# EAGLE design IR Controller v2 (EAGLE 9.4.2)
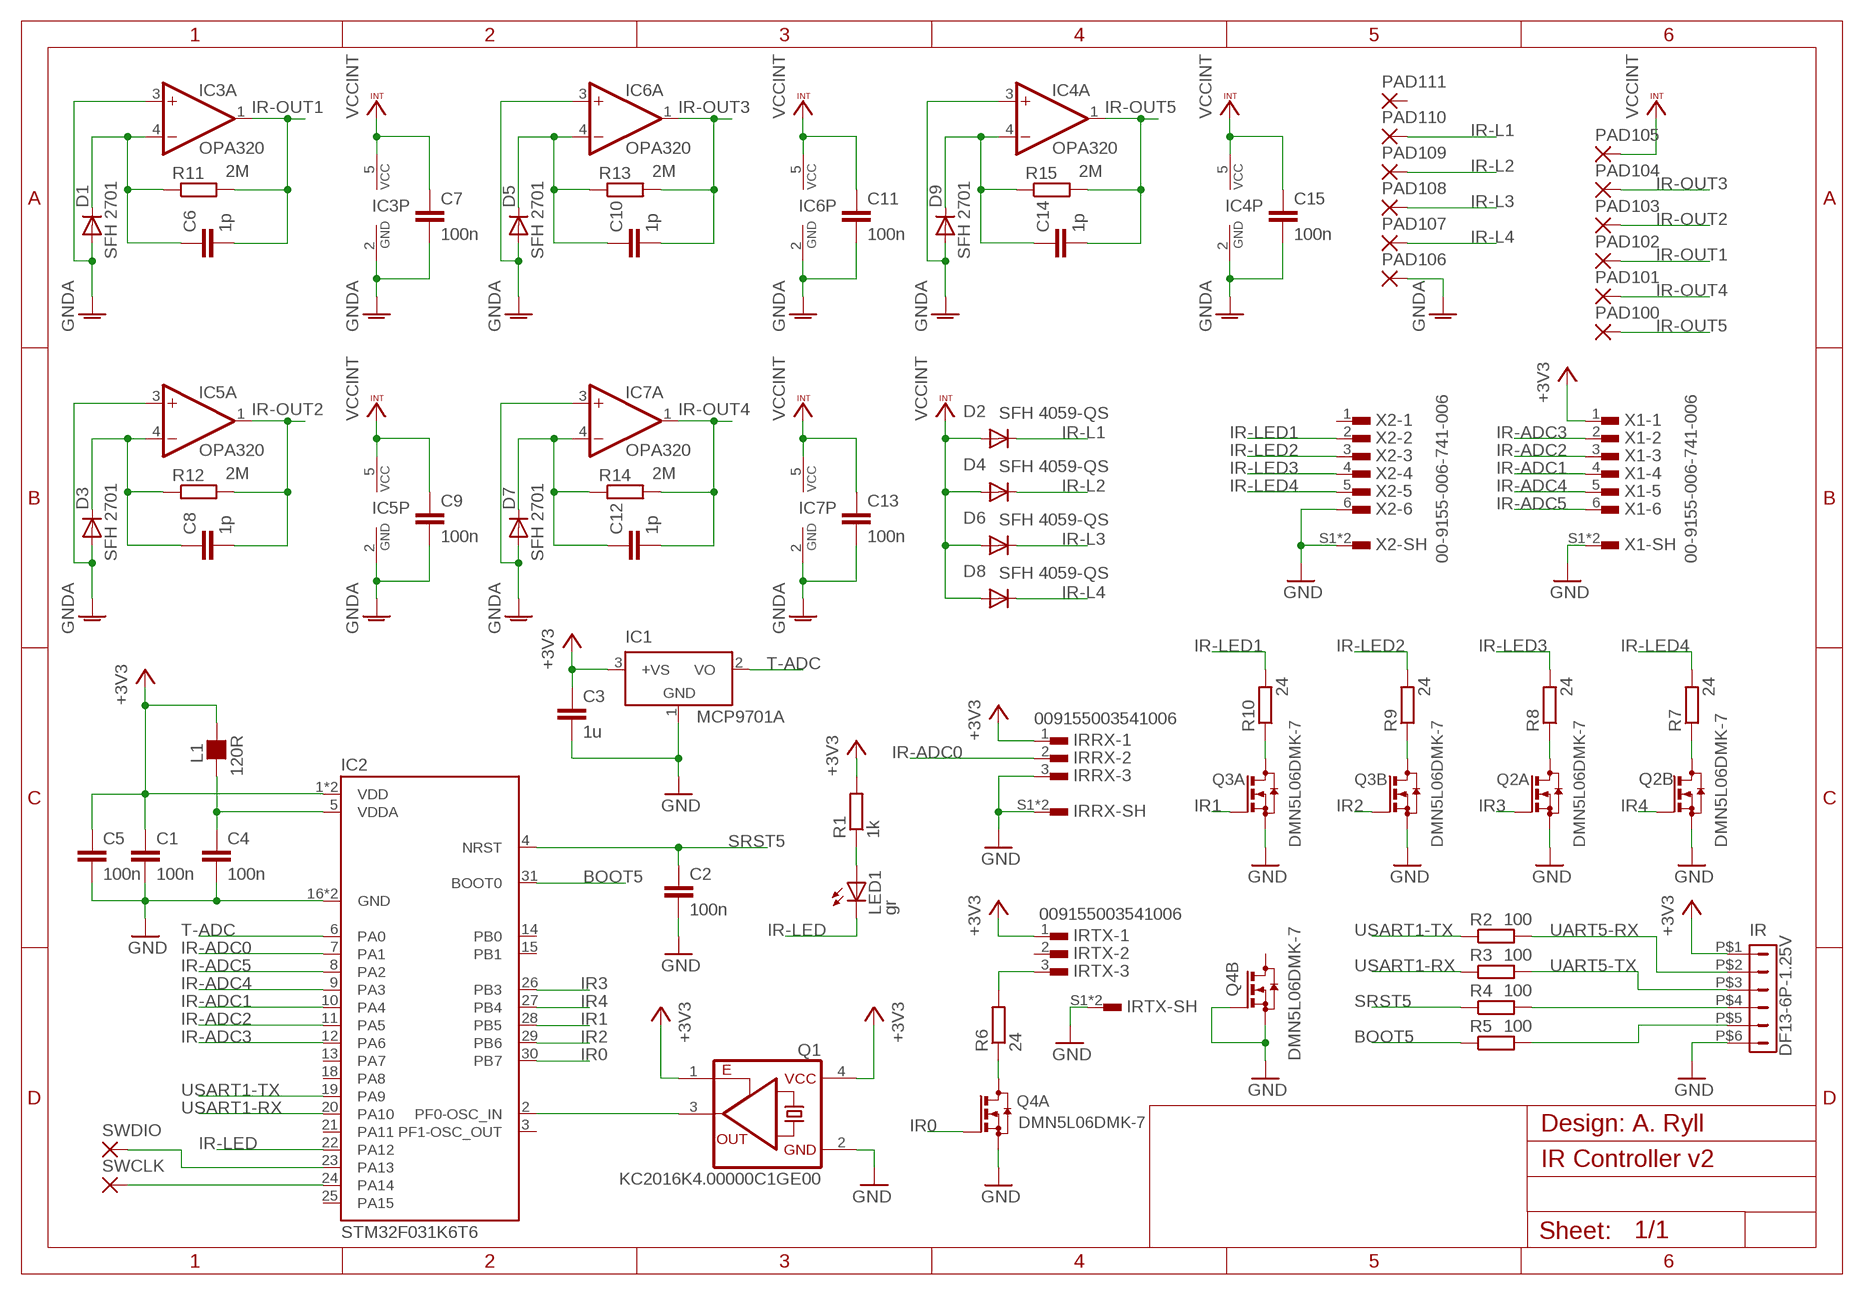
[diagram p0: schematic, sheet 1]

## Parts
C1  100n  C-EUC0603  [C0603]
C2  100n  C-EUC0603  [C0603]
C3  1u  C-EUC0603  [C0603]
C4  100n  C-EUC0603  [C0603]
C5  100n  C-EUC0603  [C0603]
C6  1p  C-EUC0603  [C0603]
C7  100n  C-EUC0603  [C0603]
C8  1p  C-EUC0603  [C0603]
C9  100n  C-EUC0603  [C0603]
C10  1p  C-EUC0603  [C0603]
C11  100n  C-EUC0603  [C0603]
C12  1p  C-EUC0603  [C0603]
C13  100n  C-EUC0603  [C0603]
C14  1p  C-EUC0603  [C0603]
C15  100n  C-EUC0603  [C0603]
D1  SFH 2701  DIODEG  [LED-GULL]
D2  SFH 4059-QS  DIODEG  [LED-GULL]
D3  SFH 2701  DIODEG  [LED-GULL]
D4  SFH 4059-QS  DIODEG  [LED-GULL]
D5  SFH 2701  DIODEG  [LED-GULL]
D6  SFH 4059-QS  DIODEG  [LED-GULL]
D7  SFH 2701  DIODEG  [LED-GULL]
D8  SFH 4059-QS  DIODEG  [LED-GULL]
D9  SFH 2701  DIODEG  [LED-GULL]
IC1  MCP9701A  LM60P  [TO92]
IC2  STM32F031K6T6  STM32F031K_TT  [LQFP32-ST]
IC3  OPA320  AD-OP1RT  [SOT23-5]
IC4  OPA320  AD-OP1RT  [SOT23-5]
IC5  OPA320  AD-OP1RT  [SOT23-5]
IC6  OPA320  AD-OP1RT  [SOT23-5]
IC7  OPA320  AD-OP1RT  [SOT23-5]
IR  DF13-6P-1.25V  [DF13C-6P-1.25V]
IRRX  009155003541006  AVX-CON3  [AVX-CON3]
IRTX  009155003541006  AVX-CON3  [AVX-CON3]
L1  120R  FB_0603  [L0603]
LED1  gr  LEDCHIP-LED0603  [CHIP-LED0603]
PAD100  WIREPADSMD1,4-3  [SMD1,4-3]
PAD101  WIREPADSMD1,4-3  [SMD1,4-3]
PAD102  WIREPADSMD1,4-3  [SMD1,4-3]
PAD103  WIREPADSMD1,4-3  [SMD1,4-3]
PAD104  WIREPADSMD1,4-3  [SMD1,4-3]
PAD105  WIREPADSMD1,4-3  [SMD1,4-3]
PAD106  WIREPADSMD1,4-3  [SMD1,4-3]
PAD107  WIREPADSMD1,4-3  [SMD1,4-3]
PAD108  WIREPADSMD1,4-3  [SMD1,4-3]
PAD109  WIREPADSMD1,4-3  [SMD1,4-3]
PAD110  WIREPADSMD1,4-3  [SMD1,4-3]
PAD111  WIREPADSMD1,4-3  [SMD1,4-3]
Q1  KC2016K4.00000C1GE00  OSCIKC2016  [OSCI-KC2016]
Q2  DMN5L06DMK-7  NMOS2  [SOT26]
Q3  DMN5L06DMK-7  NMOS2  [SOT26]
Q4  DMN5L06DMK-7  NMOS2  [SOT26]
R1  1k  R-EU_R0603  [R0603]
R2  100  R-EU_R0805  [R0805]
R3  100  R-EU_R0805  [R0805]
R4  100  R-EU_R0805  [R0805]
R5  100  R-EU_R0805  [R0805]
R6  24  R-EU_R0805  [R0805]
R7  24  R-EU_R0805  [R0805]
R8  24  R-EU_R0805  [R0805]
R9  24  R-EU_R0805  [R0805]
R10  24  R-EU_R0805  [R0805]
R11  2M  R-EU_R0603  [R0603]
R12  2M  R-EU_R0603  [R0603]
R13  2M  R-EU_R0603  [R0603]
R14  2M  R-EU_R0603  [R0603]
R15  2M  R-EU_R0603  [R0603]
SWCLK  WIREPADSMD1,27-254  [SMD1,27-2,54]
SWDIO  WIREPADSMD1,27-254  [SMD1,27-2,54]
X1  00-9155-006-741-006  AVX-CON6  [AVX-CON6-2MM]
X2  00-9155-006-741-006  AVX-CON6  [AVX-CON6-2MM]

## Nets
+3V3: C1.1 C3.1 C5.1 IC1.3(+VS) IC2.1(VDD) IC2.17(VDD) IR.P$1 IRRX.1 IRTX.1 L1.2 Q1.1(OE) Q1.4(VCC) R1.2 X1.1
BOOT5: IC2.31(BOOT0) R5.1
GND: C1.2 C2.2 C3.2 C4.2 C5.2 IC1.1(GND) IC2.16(GND) IC2.32(GND) IR.P$6 IRRX.3 IRRX.S1 IRRX.S2 IRTX.S1 IRTX.S2 Q1.2(GND) Q2.1(B:S) Q2.4(A:S) Q3.1(B:S) Q3.4(A:S) Q4.1(B:S) Q4.2(B:G) Q4.4(A:S) X1.S1 X1.S2 X2.6 X2.S1 X2.S2
GNDA: C7.2 C9.2 C11.2 C13.2 C15.2 D1.A D3.A D5.A D7.A D9.A IC3.2(P:GND) IC3.3(A:+IN) IC4.2(P:GND) IC4.3(A:+IN) IC5.2(P:GND) IC5.3(A:+IN) IC6.2(P:GND) IC6.3(A:+IN) IC7.2(P:GND) IC7.3(A:+IN) PAD106.1(P)
IR0: IC2.30(PB7) Q4.5(A:G)
IR1: IC2.28(PB5) Q3.5(A:G)
IR2: IC2.29(PB6) Q3.2(B:G)
IR3: IC2.26(PB3) Q2.5(A:G)
IR4: IC2.27(PB4) Q2.2(B:G)
IR-ADC0: IC2.7(PA1) IRRX.2
IR-ADC1: IC2.10(PA4) X1.4
IR-ADC2: IC2.11(PA5) X1.3
IR-ADC3: IC2.12(PA6) X1.2
IR-ADC4: IC2.9(PA3) X1.5
IR-ADC5: IC2.8(PA2) X1.6
IR-L1: D2.C PAD110.1(P)
IR-L2: D4.C PAD109.1(P)
IR-L3: D6.C PAD108.1(P)
IR-L4: D8.C PAD107.1(P)
IR-LED: IC2.22(PA12) LED1.C
IR-LED1: R10.2 X2.2
IR-LED2: R9.2 X2.3
IR-LED3: R8.2 X2.4
IR-LED4: R7.2 X2.5
IR-OUT1: C6.2 IC3.1(A:OUT) PAD102.1(P) R11.2
IR-OUT2: C8.2 IC5.1(A:OUT) PAD103.1(P) R12.2
IR-OUT3: C10.2 IC6.1(A:OUT) PAD104.1(P) R13.2
IR-OUT4: C12.2 IC7.1(A:OUT) PAD101.1(P) R14.2
IR-OUT5: C14.2 IC4.1(A:OUT) PAD100.1(P) R15.2
N$1: IR.P$4 R4.2
N$2: IC2.23(PA13) SWDIO.1(P)
N$4: IR.P$5 R5.2
N$6: IC2.24(PA14) SWCLK.1(P)
N$9: C14.1 D9.C IC4.4(A:-IN) R15.1
N$51: C10.1 D5.C IC6.4(A:-IN) R13.1
N$52: C8.1 D3.C IC5.4(A:-IN) R12.1
N$55: Q3.3(A:D) R10.1
N$57: C6.1 D1.C IC3.4(A:-IN) R11.1
N$59: IC2.2(PF0-OSC_IN) Q1.3(FO)
N$65: C4.1 IC2.5(VDDA) L1.1
N$66: IRTX.3 R6.2
N$68: C12.1 D7.C IC7.4(A:-IN) R14.1
N$69: Q4.3(A:D) R6.1
N$113: Q3.6(B:D) R9.1
N$115: Q2.3(A:D) R8.1
N$117: Q2.6(B:D) R7.1
N$122: LED1.A R1.1
SRST5: C2.1 IC2.4(NRST) R4.1
T-ADC: IC1.2(VO) IC2.6(PA0)
UART5-RX: IR.P$2 R2.2
UART5-TX: IR.P$3 R3.2
USART1-RX: IC2.20(PA10) R3.1
USART1-TX: IC2.19(PA9) R2.1
VCCINT: C7.1 C9.1 C11.1 C13.1 C15.1 D2.A D4.A D6.A D8.A IC3.5(P:VCC) IC4.5(P:VCC) IC5.5(P:VCC) IC6.5(P:VCC) IC7.5(P:VCC) PAD105.1(P)
Unconnected: IC2.3(PF1-OSC_OUT) IC2.13(PA7) IC2.14(PB0) IC2.15(PB1) IC2.18(PA8) IC2.21(PA11) IC2.25(PA15) IRTX.2 PAD111.1(P) Q4.6(B:D) X2.1

## Notes on the sheet
- Design: A. Ryll

## Library data of the parts
C1-C15 = rcl:C-EU: CAPACITOR, European symbol; SPICEPREFIX: C
D1-D9 = TIGERs:DIODE
IC1 = TIGERs:LM60: LM60 Temperature Sensor -40°C to 125°C
IC2 = TIGERs:STM32F031K_T
IC3-IC7 = TIGERs:AD-OP1
IR = con-hirose-df13:DF13-6P-1.25: DF13-6P 1.25mm Pitch Miniature Crimping Connector.
IRRX IRTX = TIGERs:AVX-CON3
L1 = rc-master-smd:FB_: FERRITE BEAD
LED1 = led:LED: LED OSRAM: - CHIPLED LG R971, LG N971, LY N971, LG Q971, LY Q971, LO R971, LY R971 LH N974, LH R974 LS Q976, LO Q976, LY Q976 LO Q996 - Hyper CHIPLED LW Q18S LB Q993, LB Q99A, LB R99A - SideLED LS A670, LO A670, LY A670, LG A670, LP A670 LB A673, LV A673, LT A673, LW A673 LH A674 LY A675 LS A676, LA A676, LO A676, LY A676, LW A676 LS A679, LY A679, LG A679 - Hyper Micro SIDELED® LS Y876, LA Y876, LO Y876, LY Y876 LT Y87S - SmartLED LW L88C, LW L88S LB L89C, LB L89S, LG L890 LS L89K, LO L89K, LY L89K LS L896, LA L896, LO L896, LY L896 - TOPLED LS T670, LO T670, LY T670, LG T670, LP T670 LSG T670, LSP T670, LSY T670, LOP T670, LYG T670 LG T671, LOG T671, LSG T671 LB T673, LV T673, LT T673, LW T673 LH T674 LS T676, LA T676, LO T676, LY T676, LB T676, LH T676, LSB T676, LW T676 LB T67C, LV T67C, LT T67C, LS T67K, LO T67K, LY T67K, LW E67C LS E67B, LA E67B, LO E67B, LY E67B, LB E67C, LV E67C, LT E67C LW T67C LS T679, LY T679, LG T679 LS T770, LO T770, LY T770, LG T770, LP T770 LB T773, LV T773, LT T773, LW T773 LH T774 LS E675, LA E675, LY E675, LS T675 LS T776, LA T776, LO T776, LY T776, LB T776 LHGB T686 LT T68C, LB T68C - Hyper Mini TOPLED® LB M676 - Mini TOPLED Santana® LG M470 LS M47K, LO M47K, LY M47K Source: http://www.osram.convergy.de LUXEON: - LUMILED® LXK2-PW12-R00, LXK2-PW12-S00, LXK2-PW14-U00, LXK2-PW14-V00 LXK2-PM12-R00, LXK2-PM12-S00, LXK2-PM14-U00 LXK2-PE12-Q00, LXK2-PE12-R00, LXK2-PE12-S00, LXK2-PE14-T00, LXK2-PE14-U00 LXK2-PB12-K00, LXK2-PB12-L00, LXK2-PB12-M00, LXK2-PB14-N00, LXK2-PB14-P00, LXK2-PB14-Q00 LXK2-PR12-L00, LXK2-PR12-M00, LXK2-PR14-Q00, LXK2-PR14-R00 LXK2-PD12-Q00, LXK2-PD12-R00, LXK2-PD12-S00 LXK2-PH12-R00, LXK2-PH12-S00 LXK2-PL12-P00, LXK2-PL12-Q00, LXK2-PL12-R00 Source: www.luxeon.com KINGBRIGHT: KA-3528ASYC Source: www.kingbright.com; SPICEPREFIX: D
PAD100-PAD111 SWCLK SWDIO = TIGERs:WIREPAD: Wire PAD connect wire on PCB
Q1 = TIGERs:OSCI
Q2-Q4 = TIGERs:NMOS2
R1-R15 = rcl:R-EU_: RESISTOR, European symbol; SPICEPREFIX: R
X1 X2 = TIGERs:AVX-CON6

## Board
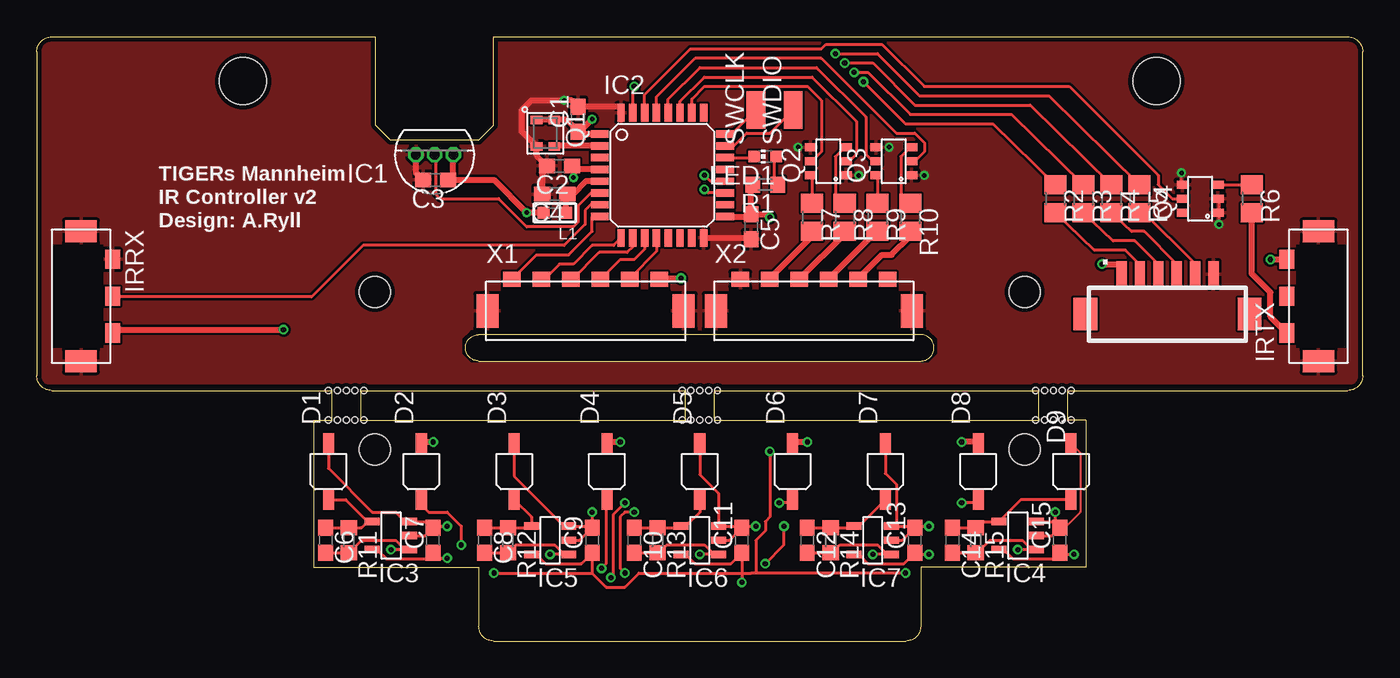
[diagram p1: board, top side]
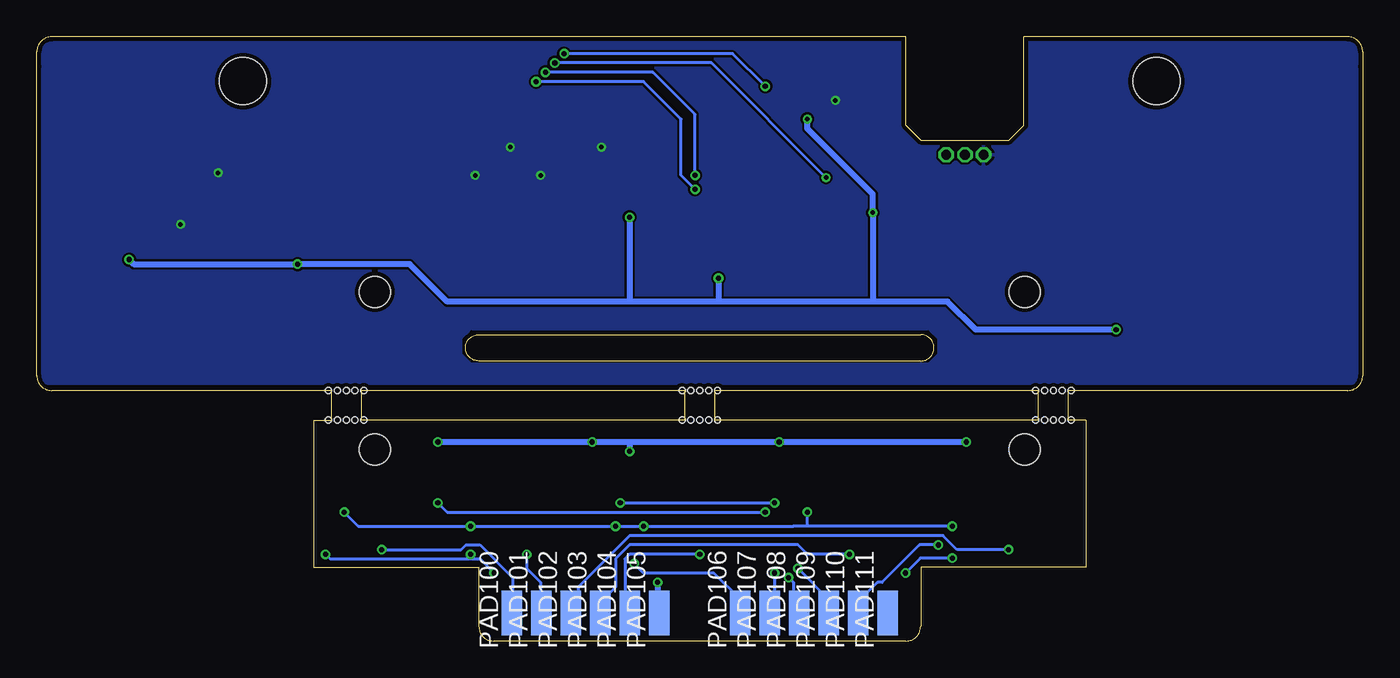
[diagram p2: board, bottom side, seen from below]

Size 90 x 41 mm. Coordinates in mm from the lower left corner, seen from the top.
Outline: 22,15 22,17
Outline: 90,18 90,39 90,40 arc90 89,41 31,41 31,35 30,34 24,34 23,35 23,41 1,41 arc90 0,40 0,39 0,18 arc90 1,17 20,17 20,15 18.8,15 18.8,5 30,5 30,1 arc90 31,0 59,0 arc90 60,1 60,5 71.2,5 71.2,15 70,15 70,17 89,17 arc90 90,18
Copper layers (1*16): Top 0.035mm / dielectric 1.5mm / Bottom 0.035mm
Design rules "PCB-POOL Standard *": minimum track width 0.15mm, minimum drill 0.3mm, track to track 0.15mm, track to pad 0.15mm, pad to pad 0.15mm, via to via 0.15mm, smd to smd 0.15mm, copper to edge 0.3mm, drill to drill 0.2mm, minimum pad ring 0.2mm, minimum via ring 0.15mm, stop-mask expansion 0.075mm, vias tented up to drill 14mil, thermal gap 0.2mm
Holes 3.2 mm at 14,38 76,38
Holes 2.1 mm at 22.95,23.7 67.05,23.7 22.95,13 67.05,13
Holes 0.4 mm at 21,15 21.6,15 22.2,15 20.4,15 19.8,15 21,17 21.6,17 22.2,17 20.4,17 19.8,17 45,15 45.6,15 46.2,15 44.4,15 43.8,15 45,17 45.6,17 46.2,17 44.4,17 43.8,17 69,15 69.6,15 70.2,15 68.4,15 67.8,15 69,17 69.6,17 70.2,17 68.4,17 67.8,17
tKeepout: area 11,35 to 17,41; area 73,35 to 79,41; area 20.9,21.7 to 24.9,25.7; area 65,21.7 to 69,25.7; area 20.9,11 to 24.9,15; area 65,11 to 69,15
Milling: 12 lines

### Footprints (pad centres in the part's own frame; a part is rotated, then mirrored left to right if it is on the bottom)
C0603 = smd 1.1 x 1: 1 -0.85,0; 2 0.85,0
LED-GULL = smd 1.4 x 0.75: A 1.9,0; C -1.9,0
TO92 = drill 0.65 pad 0.813 octagon: 1 1.27,0; 2 0,0; 3 -1.27,0
LQFP32-ST = smd 1.2 x 0.5: 1 -4.25,2.8; 2 -4.25,2; 3 -4.25,1.2; 4 -4.25,0.4; 5 -4.25,-0.4; 6 -4.25,-1.2; 7 -4.25,-2; 8 -4.25,-2.8; 17 4.25,-2.8; 18 4.25,-2; 19 4.25,-1.2; 20 4.25,-0.4; 21 4.25,0.4; 22 4.25,1.2; 23 4.25,2; 24 4.25,2.8 | smd 0.5 x 1.2: 9 -2.8,-4.25; 10 -2,-4.25; 11 -1.2,-4.25; 12 -0.4,-4.25; 13 0.4,-4.25; 14 1.2,-4.25; 15 2,-4.25; 16 2.8,-4.25; 25 2.8,4.25; 26 2,4.25; 27 1.2,4.25; 28 0.4,4.25; 29 -0.4,4.25; 30 -1.2,4.25; 31 -2,4.25; 32 -2.8,4.25
SOT23-5 = smd 1.016 x 0.508: 1 -1.27,0.953; 2 -1.27,0; 3 -1.27,-0.953; 4 1.27,-0.953; 5 1.27,0.953
DF13C-6P-1.25V = smd 1.6 x 2.2: M$0 5.575,-1.8; M$1 -5.575,-1.8 | smd 0.7 x 1.8: P$1 -3.125,0.9; P$2 -1.875,0.9; P$3 -0.625,0.9; P$4 0.625,0.9; P$5 1.875,0.9; P$6 3.125,0.9
AVX-CON3 = smd 1.3 x 1: 1 2.5,2.15; 2 0,2.15; 3 -2.5,2.15 | smd 1.5 x 2.15: S1 4.4,0; S2 -4.4,0
L0603 = smd 0.8 x 0.8: 1 -0.762,0; 2 0.762,0
CHIP-LED0603 = smd 0.8 x 0.8: A 0,-0.75; C 0,0.75
SMD1,4-3 = smd 1.4 x 3: 1 0,0
OSCI-KC2016 = smd 0.6 x 0.8: 1 -0.9,-0.6; 2 0.9,-0.6; 3 0.9,0.6; 4 -0.9,0.6
SOT26 = smd 0.55 x 0.8: 1 -0.95,-1.2; 2 0,-1.2; 3 0.95,-1.2; 4 0.95,1.2; 5 0,1.2; 6 -0.95,1.2
R0603 = smd 1 x 1.1: 1 -0.85,0; 2 0.85,0
R0805 = smd 1.3 x 1.5: 1 -0.95,0; 2 0.95,0
SMD1,27-2,54 = smd 1.27 x 2.54: 1 0,0
AVX-CON6-2MM = smd 1.2 x 1: 1 5,2.15; 2 3,2.15; 3 1,2.15; 4 -1,2.15; 5 -3,2.15; 6 -5,2.15 | smd 1.5 x 2.3: S1 6.65,0; S2 -6.65,0

### Placement (x,y rotation side)
C1  36.74,35.41 90 top
C2  35.48,32.24 180 top
C3  27.06,31.29 180 top
C4  35.16,30.34 180 top
C5  48.49,28.11 270 top
C6  19.6,6.84 270 top
C7  26.9,6.84 90 top
C8  30.39,6.84 270 top
C9  37.7,6.84 90 top
C10  40.55,6.84 270 top
C11  47.86,6.84 90 top
C12  52.3,6.84 270 top
C13  59.61,6.84 90 top
C14  62.14,6.84 270 top
C15  69.45,6.84 90 top
D1  19.8,11.5 90 top
D2  26.1,11.5 90 top
D3  32.4,11.5 90 top
D4  38.7,11.5 90 top
D5  45,11.5 90 top
D6  51.3,11.5 90 top
D7  57.6,11.5 90 top
D8  63.9,11.5 90 top
D9  70.2,11.5 90 top
IC1  27,33 180 top
IC2  42.46,31.61 0 top
IC3  24.05,7.16 180 top
IC4  66.59,7.16 180 top
IC5  34.84,6.84 180 top
IC6  45,6.84 180 top
IC7  56.75,6.84 180 top
IR  76.75,23.98 0 top
IRRX  3,23.4 270 top
IRTX  87,23.4 90 top
L1  35.16,29.06 180 top
LED1  49.45,32.88 90 top
PAD100  57.75,1.9 0 bottom
PAD101  55.75,1.9 0 bottom
PAD102  53.75,1.9 0 bottom
PAD103  51.75,1.9 0 bottom
PAD104  49.75,1.9 0 bottom
PAD105  47.75,1.9 0 bottom
PAD106  42.25,1.9 0 bottom
PAD107  40.25,1.9 0 bottom
PAD108  38.25,1.9 0 bottom
PAD109  36.25,1.9 0 bottom
PAD110  34.25,1.9 0 bottom
PAD111  32.25,1.9 0 bottom
Q1  34.52,34.46 270 top
Q2  53.73,32.56 90 top
Q3  58.18,32.56 90 top
Q4  78.97,30.02 90 top
R1  49.45,30.97 180 top
R2  69.13,30.02 270 top
R3  71.03,30.02 270 top
R4  72.94,30.02 270 top
R5  74.84,30.02 270 top
R6  82.47,30.02 270 top
R7  52.62,28.75 270 top
R8  54.84,28.75 270 top
R9  57.06,28.75 270 top
R10  59.29,28.75 270 top
R11  21.19,6.84 270 top
R12  31.98,6.84 270 top
R13  42.14,6.84 270 top
R14  53.89,6.84 270 top
R15  63.73,6.84 270 top
SWCLK  48.81,36.05 0 top
SWDIO  51.35,36.05 0 top
X1  37.25,22.4 0 top
X2  52.75,22.4 0 top

### Tracks (layer width: path | path; a pad name or v marks a point on that pad's centre or on a via)
+3V3  (via drill 0.3, 0.35)
  Top 0.406: C1.1 36.85,34.56 v37.7,35.41 | IC2.1 36.91,34.41 C1.1 | C1.1 35.95,35.36 Q1.4 Q1.1 | L1.2 v33.25,29.06 31.03,31.29 C3.1 28.27,31.65 IC1.3 | IC2.17 48.34,28.8 C5.1 | IRRX.1 5.4,20.9 5.63,21.13 v16.74,21.13 | X1.1 42.32,24.62 v43.73,24.62 | v49.76,28.75 49.55,28.96 C5.1 | C5.1 48.49,30.87 R1.2 | v72.31,25.57 73.58,25.57 73.62,25.52 IR.P$1 | IRTX.1 v83.73,25.89
  Bottom 0.406: v37.7,35.41 37.7,34.78 33.25,30.34 v33.25,29.06 33.25,23.03 | v16.74,21.13 26.27,21.13 28.17,23.03 33.25,23.03 | 33.25,23.03 43.73,23.03 | 43.73,23.03 49.76,23.03 | v43.73,24.62 43.73,23.03 | v49.76,28.75 49.76,23.03 | 49.76,23.03 62.14,23.03 64.69,25.57 v72.31,25.57 83.42,25.57 v83.73,25.89
BOOT5  (via drill 0.35)
  Top 0.203: IC2.31 40.46,37.54 v40.55,37.64 | v54.21,39.86 57.06,39.86 59.92,37 68.71,37 R5.1
  Bottom 0.203: v40.55,37.64 42.78,39.86 v54.21,39.86
GND  (via drill 0.3)
  Top 0.203: Q4.4 77.7,31.04 v77.7,31.76 | Q4.1 80.24,29 | 80.24,29 v80.24,28.27 | Q4.2 80.24,29.95 80.24,29
  Top 0.406: IC2.32 39.66,36.27 C1.2 36.33,36.69 v35.79,36.69 33.57,36.69 32.94,36.05 32.94,34.55 Q1.2 33.92,32.94 C2.2 34.31,31.92 C4.2 | IC2.16 48.4,27.36 C5.2 | C3.2 25.73,31.77 IC1.1
  other vias: 55.8,31.61 57.86,33.51 60.24,31.61 51.67,33.51
  pour Top: 0,41 90,41 90,17.5 0,17.5
  pour Bottom: 0,41 90,41 90,17.5 0,17.5
  cutout Top: 29,20 29,20.5 29.5,21 60.5,21 61,20.5 61,19.5 60.5,19 29.5,19 29,19.5
  cutout Bottom: 61,20 61,20.5 60.5,21 29.5,21 29,20.5 29,19.5 29.5,19 60.5,19 61,19.5
GNDA  (via drill 0.35)
  Top 0.152: D9.A 70.82,12.78 70.82,8.74 69.77,7.69 C15.2
  Top 0.203: D1.A 19.8,11.72 22.77,8.74 24.36,8.74 25,8.11 IC3.3 26.48,8.11 C7.2 | IC3.2 26.37,7.16 C7.2 | IC5.2 36.85,6.84 C9.2 37.65,7.74 | 37.65,7.74 37.59,7.79 IC5.3 35.79,7.79 32.4,11.18 D3.A | IC6.2 47.01,6.84 C11.2 | C11.2 47.76,7.79 IC6.3 46.27,10.02 45,11.29 D5.A | IC7.2 58.76,6.84 C13.2 | IC7.3 58.34,7.79 | 58.34,7.79 59.5,7.79 C13.2 | D7.A 57.6,11.38 58.34,10.65 58.34,7.79 | IC4.2 68.91,7.16 C15.2 | IC4.3 69.03,8.11 C15.2 | C7.2 27,7.79 v27.86,7.79 | 37.65,7.74 37.7,7.79 v37.7,8.74 | C11.2 47.96,7.79 v48.81,7.79 | C13.2 59.71,7.79 v60.56,7.79 | C15.2 69.13,8.01 v69.13,8.74 | v49.45,5.25 50.72,6.52 v50.72,7.79
  Bottom 0.203: v27.86,7.79 37.7,7.79 | 37.7,7.79 38.65,7.79 v48.81,7.79 v50.72,7.79 v60.56,7.79 68.18,7.79 v69.13,8.74 | 37.7,7.79 v37.7,8.74 | PAD106.1 42.25,2.82 44.05,4.62 48.81,4.62 v49.45,5.25
IR0
  Top 0.203: IC2.30 41.26,37.07 44.37,40.18 53.26,40.18 53.57,40.5 57.38,40.5 60.24,37.64 70.08,37.64 76.11,31.61 76.11,30.97 77.07,30.02 Q4.5
IR1
  Top 0.203: IC2.28 42.86,36.77 45,38.91 52.94,38.91 56.27,35.57 56.27,33.03 56.75,32.56 Q3.5
IR2
  Top 0.203: IC2.29 42.06,36.92 44.68,39.54 53.26,39.54 58.34,34.46 59.61,34.46 60.24,33.83 60.24,33.19 59.61,32.56 Q3.2
IR3
  Top 0.203: Q2.5 52.62,32.56 53.26,33.19 53.26,36.69 52.3,37.64 45.32,37.64 44.46,36.78 IC2.26
IR4
  Top 0.203: Q2.2 55.16,32.56 55.64,33.03 55.64,35.26 52.62,38.27 45.32,38.27 43.66,36.61 IC2.27
IR-ADC0
  Top 0.203: IC2.7 37.6,29.61 37.22,29.22 37.22,28.27 35.79,26.84 22.14,26.84 18.65,23.35 5.2,23.35 IRRX.2
IR-ADC1
  Top 0.203: IC2.10 40.46,26.75 40.08,26.37 38.17,26.37 36.36,24.55 X1.4
IR-ADC2
  Top 0.203: IC2.11 41.26,26.59 40.55,25.89 39.59,25.89 X1.3
IR-ADC3
  Top 0.203: IC2.12 42.06,26.44 40.25,24.63 X1.2
IR-ADC4
  Top 0.203: 34.25,24.66 X1.5 34.45,24.55 35.48,25.57 36.43,25.57 37.7,26.84 39.15,26.84 IC2.9
IR-ADC5
  Top 0.203: IC2.8 37.76,28.8 37.7,28.75 37.7,27.8 36.11,26.21 33.91,26.21 X1.6
IR-L1  (via drill 0.35)
  Top 0.203: D2.C 26.1,9.23 26.59,8.74 27.86,8.74 28.81,7.79 v28.81,6.52
  Bottom 0.203: v28.81,6.52 30.08,6.52 32.62,3.98 32.94,3.98 34.25,2.67 PAD110.1
IR-L2  (via drill 0.35)
  Top 0.203: 38.7,9.33 D4.C 38.65,9.55 38.65,5.25 v38.33,4.94
  Bottom 0.203: PAD109.1 36.25,2.85 v38.33,4.94
IR-L3  (via drill 0.35)
  Top 0.203: 51.3,9.33 D6.C 51.08,9.38 v50.4,9.38 | v39.92,9.38 39.13,8.59 39.13,4.46 v38.97,4.3
  Bottom 0.203: v50.4,9.38 v39.92,9.38 | v38.97,4.3 38.65,3.98 38.65,2.3 PAD108.1
IR-L4  (via drill 0.35)
  Top 0.203: 63.9,9.23 D8.C 63.68,9.38 v62.78,9.38 | v40.55,8.74 39.92,8.74 39.6,8.43 39.6,4.94 v39.92,4.62
  Bottom 0.203: 40.55,2.21 40.33,1.98 | 40.33,1.98 PAD107.1 | v62.78,9.38 62.14,8.74 v40.55,8.74 | 40.33,1.98 39.92,2.39 v39.92,4.62
IR-LED
  Top 0.203: IC2.22 48.77,32.8 LED1.C
IR-LED1
  Top 0.203: X2.2 55.75,24.57
  Top 0.406: 55.75,24.57 57.38,26.21 58.02,26.21 59.29,27.48 R10.2
IR-LED2
  Top 0.406: X2.3 57,27.8 R9.2
IR-LED3
  Top 0.406: R8.2 54.84,27.64 X2.4
IR-LED4
  Top 0.406: X2.5 49.75,24.61 52.62,27.48 R7.2
IR-OUT1  (via drill 0.35)
  Top 0.203: C6.2 R11.2 22.04,6.84 24.36,6.84 25,6.21 IC3.1 v24.05,6.21
  Bottom 0.203: v24.05,6.21 27.54,6.21 28.49,7.16 49.76,7.16 53.26,3.66 53.26,2.39 PAD102.1
IR-OUT2  (via drill 0.35)
  Top 0.203: C8.2 R12.2 32.52,6.52 35.16,6.52 35.79,5.89 IC5.1 v34.84,5.89
  Bottom 0.203: v34.84,5.89 37.7,5.89 38.33,6.52 49.76,6.52 50.72,5.57 50.72,3.66 51.75,2.63 PAD103.1
IR-OUT3  (via drill 0.35)
  Top 0.203: C10.2 R13.2 42.24,5.99 42.78,6.52 45.32,6.52 45.95,5.89 IC6.1 v45,5.89
  Bottom 0.203: v45,5.89 49.76,5.89 50.08,5.57 50.08,2.23 PAD104.1
IR-OUT4  (via drill 0.35)
  Top 0.203: C12.2 R14.2 53.99,5.99 54.52,6.52 57.06,6.52 57.7,5.89 IC7.1 v56.75,5.89
  Bottom 0.203: v56.75,5.89 56.75,4.94 55.8,3.98 55.8,1.95 PAD101.1
IR-OUT5  (via drill 0.35)
  Top 0.203: C14.2 R15.2 63.84,5.99 64.69,6.84 66.91,6.84 67.54,6.21 IC4.1 v66.59,6.21
  Bottom 0.203: v66.59,6.21 61.19,6.21 60.88,6.52 59.92,6.52 57.7,4.3 57.7,1.95 PAD100.1
N$1
  Top 0.203: IR.P$4 77.38,25.58 75.16,27.8 74.31,27.8 R4.2
N$2
  Top 0.203: IC2.23 47.32,33.61 48.17,34.46 49.76,34.46 SWDIO.1
N$4
  Top 0.203: IR.P$5 78.62,25.6 75.06,29.17 R5.2
N$6
  Top 0.203: IC2.24 47.16,34.41 SWCLK.1
N$9
  Top 0.203: C14.1 R15.1 64.05,8.01 64.05,8.11 IC4.4 66.81,9.6 D9.C
N$51
  Top 0.203: C10.1 R13.1 43.63,7.69 IC6.4 44.05,7.79 45,8.74 D5.C
N$52
  Top 0.203: C8.1 R12.1 33.47,7.69 IC5.4 33.57,8.43 D3.C
N$55
  Top 0.203: Q3.3 59.28,33.51 58.65,32.88 58.65,30.02 58.97,29.7 R10.1
N$57
  Top 0.203: 19.92,9.48 D1.C 20.97,9.6 22.46,8.11 | 19.92,8.01 C6.1 R11.1 22.04,7.69 22.46,8.11 | 22.46,8.11 IC3.4
N$59
  Top 0.406: IC2.2 35.16,33.61 Q1.3
N$65
  Top 0.406: IC2.5 37.3,31.2 36.43,30.34 C4.1 35.92,30.25 L1.1
N$66
  Top 0.406: IRTX.3 83.73,22.02 83.73,23.67 82.47,24.94 R6.2
N$68
  Top 0.203: C12.1 R14.1 55.38,7.69 IC7.4 55.79,7.79 D7.C
N$69
  Top 0.203: Q4.3 R6.1
N$113
  Top 0.203: Q3.6 57.06,31.52 R9.1
N$115
  Top 0.203: Q2.3 54.84,33.51 54.21,32.88 54.21,30.33 R8.1
N$117
  Top 0.203: Q2.6 52.62,31.52 R7.1
N$122
  Top 0.203: R1.1 50.08,31.19 50.08,32.76 LED1.A
SRST5  (via drill 0.3, 0.35)
  Top 0.203: v54.84,39.23 56.75,39.23 59.61,36.37 67.44,36.37 R4.1
  Top 0.406: v36.43,31.45 36.43,32.14 C2.1 36.56,32.01 IC2.4
  Bottom 0.203: v36.43,31.45 44.21,39.23 v54.84,39.23
T-ADC
  Top 0.203: IC2.6 37.61,30.41 36.74,29.54 36.74,28.43 36.43,28.11 33.25,28.11 31.35,30.02 27.38,30.02 27.06,30.34 27.06,32.94 IC1.2
UART5-RX
  Top 0.203: IR.P$2 74.88,25.54 73.89,26.52 71.77,26.52 R2.2
UART5-TX
  Top 0.203: IR.P$3 76.12,25.56 74.53,27.16 73.04,27.16 R3.2
USART1-RX  (via drill 0.35)
  Top 0.203: IC2.20 45.72,31.2 v45.32,31.61 | v55.48,38.59 56.43,38.59 59.29,35.73 66.17,35.73 R3.1
  Bottom 0.203: v45.32,31.61 45.32,35.73 48.17,38.59 v55.48,38.59
USART1-TX  (via drill 0.35)
  Top 0.203: IC2.19 45.56,30.41 v45.32,30.65 | v56.11,37.95 58.97,35.1 64.9,35.1 R2.1
  Bottom 0.203: v45.32,30.65 46.27,31.61 46.27,35.41 48.81,37.95 v56.11,37.95
VCCINT  (via drill 0.35)
  Top 0.203: IC3.5 23.09,6.21 23.73,5.57 26.48,5.57 C7.1 27.27,5.62 v27.86,5.62 | IC5.5 33.89,5.89 34.52,5.25 36.96,5.25 C9.1 37.7,4.62 | IC6.5 44.05,5.89 44.68,5.25 47.12,5.25 C11.1 47.86,4.62 | IC7.5 55.8,5.89 56.43,5.25 58.87,5.25 C13.1 59.71,5.89 v60.56,5.89 | IC4.5 65.64,6.21 66.27,5.57 69.03,5.57 C15.1 69.55,5.89 v70.4,5.89 | v58.97,4.62 48.81,4.62 | 48.81,4.62 48.49,4.62 47.86,4.62 | v31.03,4.62 37.7,4.62 | 47.86,4.62 v47.86,3.98 | v49.76,12.87 49.76,8.43 49.45,8.11 49.45,7.47 48.81,6.84 48.81,4.62 | 37.7,4.62 38.65,3.66 39.92,3.66 40.87,4.62 47.86,4.62
  Top 0.406: D2.A 26.21,13.51 v26.9,13.51 | D4.A 38.81,13.51 v39.6,13.51 | D6.A 51.41,13.51 v52.3,13.51 | D8.A 63.79,13.51 v62.78,13.51
  Bottom 0.203: v27.86,5.62 30.02,5.62 v31.03,4.62 | v70.4,5.89 70.08,5.57 60.56,5.57 | v58.97,4.62 59.92,5.57 60.56,5.57 | v60.56,5.89 60.56,5.57
  Bottom 0.406: v26.9,13.51 v39.6,13.51 49.76,13.51 | 49.76,13.51 v52.3,13.51 v62.78,13.51 | 49.76,13.51 v49.76,12.87 | v47.86,3.98 47.86,2.01 PAD105.1

### Text on the board
tPlace: TIGERs Mannheim | IR Controller v2 | Design: A.Ryll